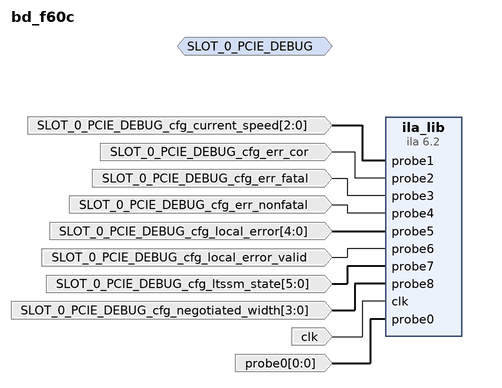
[diagram p0: block diagram of the top level]
# Vivado block design bd_f60c, xc7a200tfbg484-2, Vivado 2025.2
create_bd_design bd_f60c

create_bd_intf_port -mode Monitor -vlnv xilinx.com:display_xdma:pcie_debug_rtl:1.0 SLOT_0_PCIE_DEBUG
create_bd_port -dir I -type clk clk
set_property -dict {CONFIG.ASSOCIATED_BUSIF SLOT_0_AXI CONFIG.ASSOCIATED_RESET resetn} [get_bd_ports clk]
create_bd_port -dir I -from 0 -to 0 probe0
create_bd_port -dir I -from 2 -to 0 SLOT_0_PCIE_DEBUG_cfg_current_speed
create_bd_port -dir I SLOT_0_PCIE_DEBUG_cfg_err_cor
create_bd_port -dir I SLOT_0_PCIE_DEBUG_cfg_err_fatal
create_bd_port -dir I SLOT_0_PCIE_DEBUG_cfg_err_nonfatal
create_bd_port -dir I -from 4 -to 0 SLOT_0_PCIE_DEBUG_cfg_local_error
create_bd_port -dir I SLOT_0_PCIE_DEBUG_cfg_local_error_valid
create_bd_port -dir I -from 5 -to 0 SLOT_0_PCIE_DEBUG_cfg_ltssm_state
create_bd_port -dir I -from 3 -to 0 SLOT_0_PCIE_DEBUG_cfg_negotiated_width

create_bd_cell -type ip -vlnv xilinx.com:ip:ila:6.2 ila_lib
set_property -dict [list \
  CONFIG.ALL_PROBE_SAME_MU TRUE \
  CONFIG.ALL_PROBE_SAME_MU_CNT 1 \
  CONFIG.C_ADV_TRIGGER FALSE \
  CONFIG.C_DATA_DEPTH 8192 \
  CONFIG.C_EN_STRG_QUAL 0 \
  CONFIG.C_ILA_CLK_FREQ 125000000 \
  CONFIG.C_INPUT_PIPE_STAGES 0 \
  CONFIG.C_MONITOR_TYPE Native \
  CONFIG.C_NUM_OF_PROBES 9 \
  CONFIG.C_PROBE0_MU_CNT 1 \
  CONFIG.C_PROBE0_TYPE 0 \
  CONFIG.C_PROBE0_WIDTH 1 \
  CONFIG.C_PROBE1_TYPE 0 \
  CONFIG.C_PROBE1_WIDTH 3 \
  CONFIG.C_PROBE2_TYPE 0 \
  CONFIG.C_PROBE2_WIDTH 1 \
  CONFIG.C_PROBE3_TYPE 0 \
  CONFIG.C_PROBE3_WIDTH 1 \
  CONFIG.C_PROBE4_TYPE 0 \
  CONFIG.C_PROBE4_WIDTH 1 \
  CONFIG.C_PROBE5_TYPE 0 \
  CONFIG.C_PROBE5_WIDTH 5 \
  CONFIG.C_PROBE6_TYPE 0 \
  CONFIG.C_PROBE6_WIDTH 1 \
  CONFIG.C_PROBE7_TYPE 0 \
  CONFIG.C_PROBE7_WIDTH 6 \
  CONFIG.C_PROBE8_TYPE 0 \
  CONFIG.C_PROBE8_WIDTH 4 \
  CONFIG.C_TRIGIN_EN false \
  CONFIG.C_TRIGOUT_EN false \
  CONFIG.C_XLNX_HW_PROBE_INFO DEFAULT \
] [get_bd_cells ila_lib]

# ---- connections ----

connect_bd_net [get_bd_ports SLOT_0_PCIE_DEBUG_cfg_current_speed] [get_bd_pins ila_lib/probe1]
connect_bd_net [get_bd_ports SLOT_0_PCIE_DEBUG_cfg_err_cor] [get_bd_pins ila_lib/probe2]
connect_bd_net [get_bd_ports SLOT_0_PCIE_DEBUG_cfg_err_fatal] [get_bd_pins ila_lib/probe3]
connect_bd_net [get_bd_ports SLOT_0_PCIE_DEBUG_cfg_err_nonfatal] [get_bd_pins ila_lib/probe4]
connect_bd_net [get_bd_ports SLOT_0_PCIE_DEBUG_cfg_local_error] [get_bd_pins ila_lib/probe5]
connect_bd_net [get_bd_ports SLOT_0_PCIE_DEBUG_cfg_local_error_valid] [get_bd_pins ila_lib/probe6]
connect_bd_net [get_bd_ports SLOT_0_PCIE_DEBUG_cfg_ltssm_state] [get_bd_pins ila_lib/probe7]
connect_bd_net [get_bd_ports SLOT_0_PCIE_DEBUG_cfg_negotiated_width] [get_bd_pins ila_lib/probe8]
connect_bd_net [get_bd_ports clk] [get_bd_pins ila_lib/clk]
connect_bd_net -net probe0_1 [get_bd_ports probe0] [get_bd_pins ila_lib/probe0]

validate_bd_design
save_bd_design
